# EAGLE design main-uass (EAGLE 9.6.2)
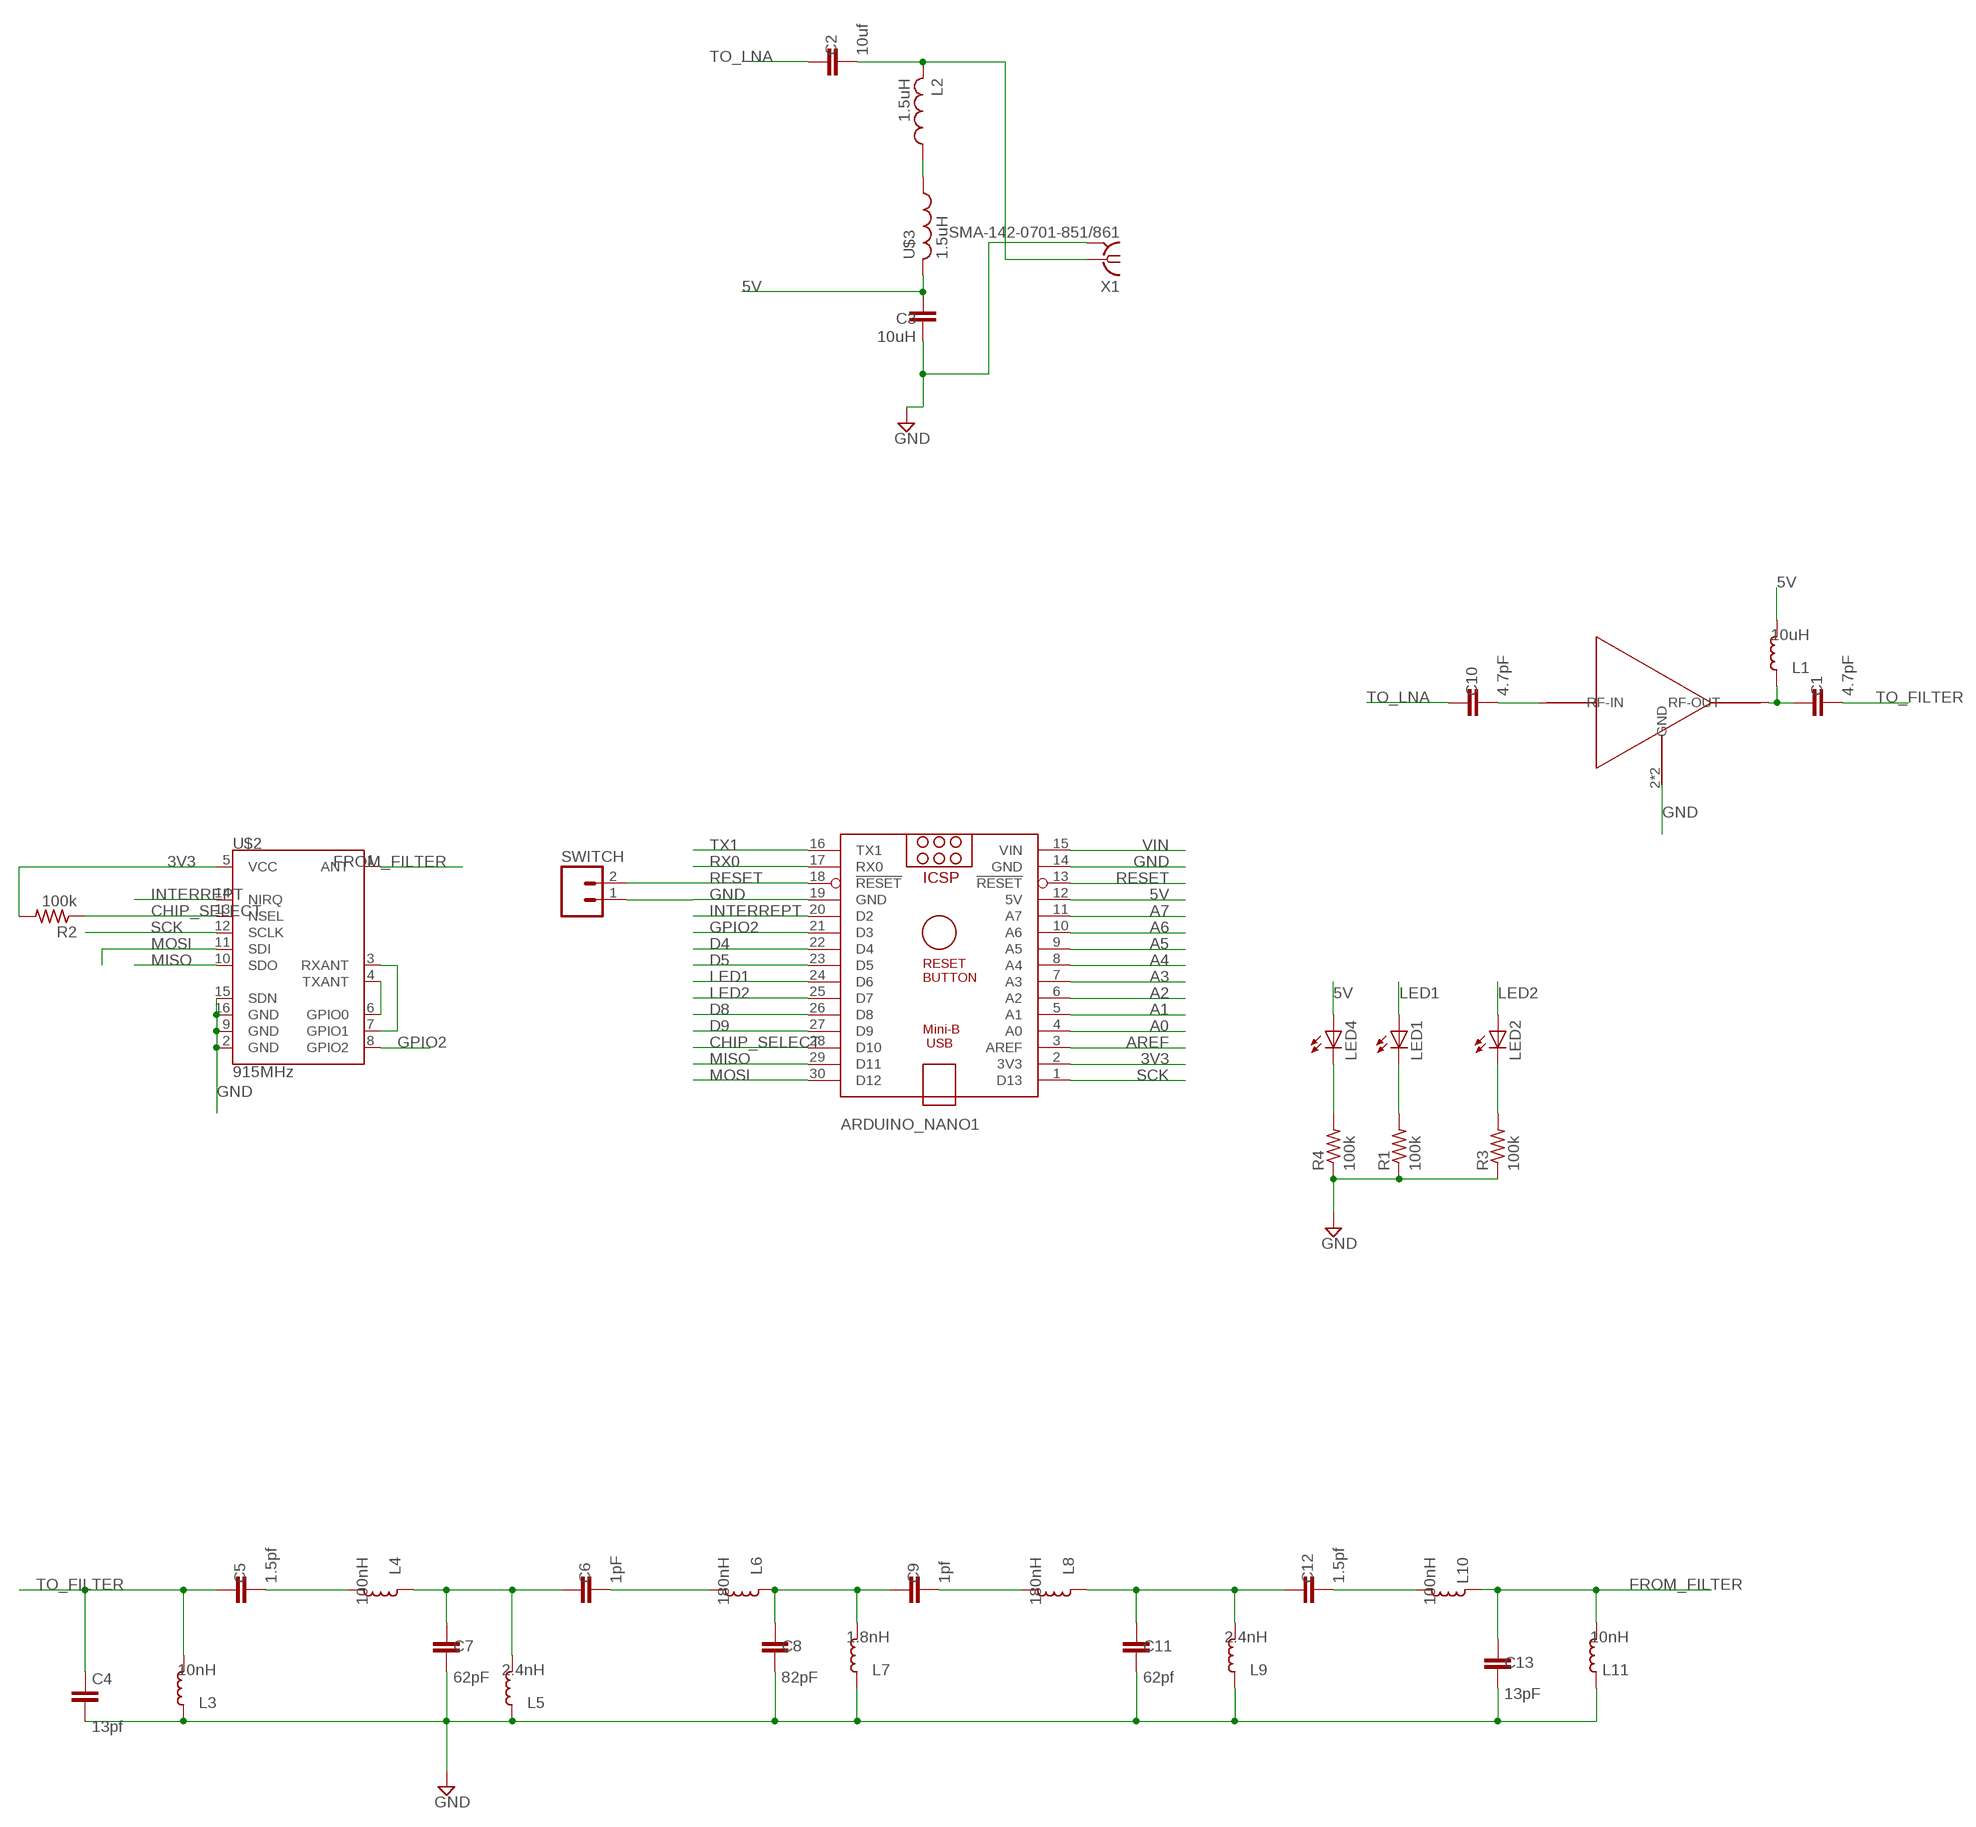
[diagram p0: schematic, sheet 1]

## Parts
ARDUINO_NANO1  ARDUINO_NANO  [ARDUINO_NANO]
C1  4.7pF  10UF-0603-6.3V-20%  [0603]
C2  10uf  10UF-0603-6.3V-20%  [0603]
C3  10uH  10UF-0603-6.3V-20%  [0603]
C4  13pf  10UF-0603-6.3V-20%  [0603]
C5  1.5pf  10UF-0603-6.3V-20%  [0603]
C6  1pF  10UF-0603-6.3V-20%  [0603]
C7  62pF  10UF-0603-6.3V-20%  [0603]
C8  82pF  10UF-0603-6.3V-20%  [0603]
C9  1pf  10UF-0603-6.3V-20%  [0603]
C10  4.7pF  10UF-0603-6.3V-20%  [0603]
C11  62pf  10UF-0603-6.3V-20%  [0603]
C12  1.5pf  10UF-0603-6.3V-20%  [0603]
C13  13pF  10UF-0603-6.3V-20%  [0603]
L1  10uH  L_0603  [L0603]
L2  1.5uH  L504  [C0504]
L3  10nH  L_0603  [L0603]
L4  100nH  L_0603  [L0603]
L5  2.4nH  L_0603  [L0603]
L6  180nH  L_0603  [L0603]
L7  1.8nH  L_0603  [L0603]
L8  180nH  L_0603  [L0603]
L9  2.4nH  L_0603  [L0603]
L10  100nH  L_0603  [L0603]
L11  10nH  L_0603  [L0603]
LED1  LED5MM  [LED5MM]
LED2  LED5MM  [LED5MM]
LED4  LED5MM  [LED5MM]
R1  100k  R-US_R0603  [R0603]
R2  100k  R-US_R0603  [R0603]
R3  100k  R-US_R0603  [R0603]
R4  100k  R-US_R0603  [R0603]
SWITCH  M02  [02P]
U$1  PSA4-5043+  [PSA4-5043+]
U$2  915MHz  RFM22915MHZ  [RFM22-XXX-S2]
U$3  1.5uH  L504  [C0504]
X1  SMA-142-0701-851/861  [J502-ND-142-0701-851/861]

## Nets
3V3: ARDUINO_NANO1.2(3V3) R2.2 U$2.5(VCC)
5V: ARDUINO_NANO1.12(5V) C3.2 L1.1 LED4.A U$3.2
A0: ARDUINO_NANO1.4(A0)
A1: ARDUINO_NANO1.5(A1)
A2: ARDUINO_NANO1.6(A2)
A3: ARDUINO_NANO1.7(A3)
A4: ARDUINO_NANO1.8(A4)
A5: ARDUINO_NANO1.9(A5)
A6: ARDUINO_NANO1.10(A6)
A7: ARDUINO_NANO1.11(A7)
AREF: ARDUINO_NANO1.3(AREF)
CHIP_SELECT: ARDUINO_NANO1.28(D10) R2.1 U$2.13(NSEL)
D4: ARDUINO_NANO1.22(D4)
D5: ARDUINO_NANO1.23(D5)
D8: ARDUINO_NANO1.26(D8)
D9: ARDUINO_NANO1.27(D9)
FROM_FILTER: C13.1 L10.2 L11.1 U$2.1(ANT)
GND: ARDUINO_NANO1.14(GND) ARDUINO_NANO1.19(GND) C3.1 C4.2 C7.2 C8.2 C11.2 C13.2 L3.2 L5.2 L7.2 L9.2 L11.2 R1.1 R3.1 R4.1 SWITCH.1 U$1.2(GND) U$1.4(GND) U$2.2(GND) U$2.9(GND) U$2.15(SDN) U$2.16(GND) X1.G@1 X1.G@2 X1.G@3 X1.G@4
GPIO2: ARDUINO_NANO1.21(D3) U$2.8(GPIO2)
INTERREPT: ARDUINO_NANO1.20(D2) U$2.14(NIRQ)
LED1: ARDUINO_NANO1.24(D6) LED1.A
LED2: ARDUINO_NANO1.25(D7) LED2.A
MISO: ARDUINO_NANO1.29(D11) U$2.10(SDO)
MOSI: ARDUINO_NANO1.30(D12) U$2.11(SDI)
N$1: U$2.4(TXANT) U$2.6(GPIO0)
N$2: U$2.3(RXANT) U$2.7(GPIO1)
N$3: L2.1 U$3.1
N$4: C5.2 L4.1
N$5: C6.1 C7.1 L4.2 L5.1
N$6: C6.2 L6.1
N$7: C8.1 C9.1 L6.2 L7.1
N$8: C9.2 L8.1
N$9: C11.1 C12.1 L8.2 L9.1
N$10: C12.2 L10.1
N$11: LED2.K(C) R3.2
N$30: LED4.K(C) R4.2
N$31: LED1.K(C) R1.2
N$33: C10.2 U$1.3(RF-IN)
N$34: C1.1 L1.2 U$1.1(RF-OUT)
N$46: C2.2 L2.2 X1.1
RESET: ARDUINO_NANO1.13(!RESET) ARDUINO_NANO1.18(!RESET) SWITCH.2
RX0: ARDUINO_NANO1.17(RX0)
SCK: ARDUINO_NANO1.1(D13) U$2.12(SCLK)
TO_FILTER: C1.2 C4.1 C5.1 L3.1
TO_LNA: C2.1 C10.1
TX1: ARDUINO_NANO1.16(TX1)
VIN: ARDUINO_NANO1.15(VIN)

## Library data of the parts
ARDUINO_NANO1 = ArduinoNanoV30:ARDUINO_NANO: Arduino Nano V3.0 Overview: The Arduino Nano is a small, complete, and breadboard-friendly board based on the ATmega328 (Arduino Nano 3.x) or ATmega168 (Arduino Nano 2.x). It has more or less the same functionality of the Arduino Duemilanove, but in a different package. It lacks only a DC power jack, and works with a Mini-B USB cable instead of a standard one. The Nano was designed and is being produced by Gravitech. Specifications: Microcontroller Atmel ATmega168 or ATmega328 Operating Voltage (logic level) 5 V Input Voltage (recommended) 7-12 V Input Voltage (limits) 6-20 V Digital I/O Pins 14 (of which 6 provide PWM output) Analog Input Pins 8 DC Current per I/O Pin 40 mA Flash Memory 16 KB (ATmega168) or 32 KB (ATmega328) of which 2 KB used by bootloader SRAM 1 KB (ATmega168) or 2 KB (ATmega328) EEPROM 512 bytes (ATmega168) or 1 KB (ATmega328) Clock Speed 16 MHz Dimensions 0.73" x 1.70" Length 45 mm Width 18 mm Weigth 5 g Power: The Arduino Nano can be powered via the Mini-B USB connection, 6-20V unregulated external power supply (pin 30), or 5V regulated external power supply (pin 27). The power source is automatically selected to the highest voltage source. Memory: The ATmega168 has 16 KB of flash memory for storing code (of which 2 KB is used for the bootloader); the ATmega328 has 32 KB, (also with 2 KB used for the bootloader). The ATmega168 has 1 KB of SRAM and 512 bytes of EEPROM (which can be read and written with the EEPROM library); the ATmega328 has 2 KB of SRAM and 1 KB of EEPROM. Input and Output: Each of the 14 digital pins on the Nano can be used as an input or output, using pinMode(), digitalWrite(), and digitalRead() functions. They operate at 5 volts. Each pin can provide or receive a maximum of 40 mA and has an internal pull-up resistor (disconnected by default) of 20-50 kOhms. In addition, some pins have specialized functions. Visit Arduino - ArduinoBoardNano <https://www.arduino.cc/en/Main/ArduinoBoardNano>
C1-C13 = SparkFun-Capacitors:10UF: 10.0µF ceramic capacitors A capacitor is a passive two-terminal electrical component used to store electrical energy temporarily in an electric field.; PROD_ID: CAP-11015; VALUE: 10uF
L1 L3-L11 = rc-master-smd:L_: INDUCTOR
L2 U$3 = rcl-2:L504
LED1 LED2 LED4 = adafruit:LED: LED OSRAM: - CHIPLED LG R971, LG N971, LY N971, LG Q971, LY Q971, LO R971, LY R971 LH N974, LH R974 LS Q976, LO Q976, LY Q976 LO Q996 - Hyper CHIPLED LW Q18S LB Q993, LB Q99A, LB R99A - SideLED LS A670, LO A670, LY A670, LG A670, LP A670 LB A673, LV A673, LT A673, LW A673 LH A674 LY A675 LS A676, LA A676, LO A676, LY A676, LW A676 LS A679, LY A679, LG A679 - Hyper Micro SIDELED® LS Y876, LA Y876, LO Y876, LY Y876 LT Y87S - SmartLED LW L88C, LW L88S LB L89C, LB L89S, LG L890 LS L89K, LO L89K, LY L89K LS L896, LA L896, LO L896, LY L896 - TOPLED LS T670, LO T670, LY T670, LG T670, LP T670 LSG T670, LSP T670, LSY T670, LOP T670, LYG T670 LG T671, LOG T671, LSG T671 LB T673, LV T673, LT T673, LW T673 LH T674 LS T676, LA T676, LO T676, LY T676, LB T676, LH T676, LSB T676, LW T676 LB T67C, LV T67C, LT T67C, LS T67K, LO T67K, LY T67K, LW E67C LS E67B, LA E67B, LO E67B, LY E67B, LB E67C, LV E67C, LT E67C LW T67C LS T679, LY T679, LG T679 LS T770, LO T770, LY T770, LG T770, LP T770 LB T773, LV T773, LT T773, LW T773 LH T774 LS E675, LA E675, LY E675, LS T675 LS T776, LA T776, LO T776, LY T776, LB T776 LHGB T686 LT T68C, LB T68C - Hyper Mini TOPLED® LB M676 - Mini TOPLED Santana® LG M470 LS M47K, LO M47K, LY M47K Source: http://www.osram.convergy.de/
R1-R4 = adafruit:R-US_: RESISTOR, American symbol
SWITCH = con-amp-quick:M02: AMP QUICK CONNECTOR; OC_FARNELL: unknown; OC_NEWARK: unknown
U$1 = PSA4-5043_:PSA4-5043+; AVAILABILITY: Unavailable; DESCRIPTION: Ultra Low Noise MMIC Amplifier, 50ohm, 0.05 to 4 GHz; MF: Mini-Circuits; MP: PSA4-5043+; PACKAGE: None; PRICE: None
U$2 = SparkFun-RF:RFM22: Hope RF RFM22 ISM Transciever Module The RFM22 is a low-power, low cost radio that is capable of operating in the 434MHz and 900MHz open bands. It's frequency is software defined and there are some very good libraries written for it. SparkFun Products SparkFun RFM22 Shield - 434MHz <https://www.sparkfun.com/products/11018> (DEV-11018); PROD_ID: IC-11750; SF_ID: WRL-12030
X1 = con-coax:SMA-: SMA 50 Ohm End Launch Jack Receptacle - Round Contact Johnson Components Source: www.johnsoncomponents.com .. J502-ND.pdf; MF: JOHNSON COMPONENTS; MPN: 142-0701-851; OC_FARNELL: 1019325; OC_NEWARK: 99F6798

## Net classes
0 default: width 0.305 mm, clearance 0.051 mm

## Board
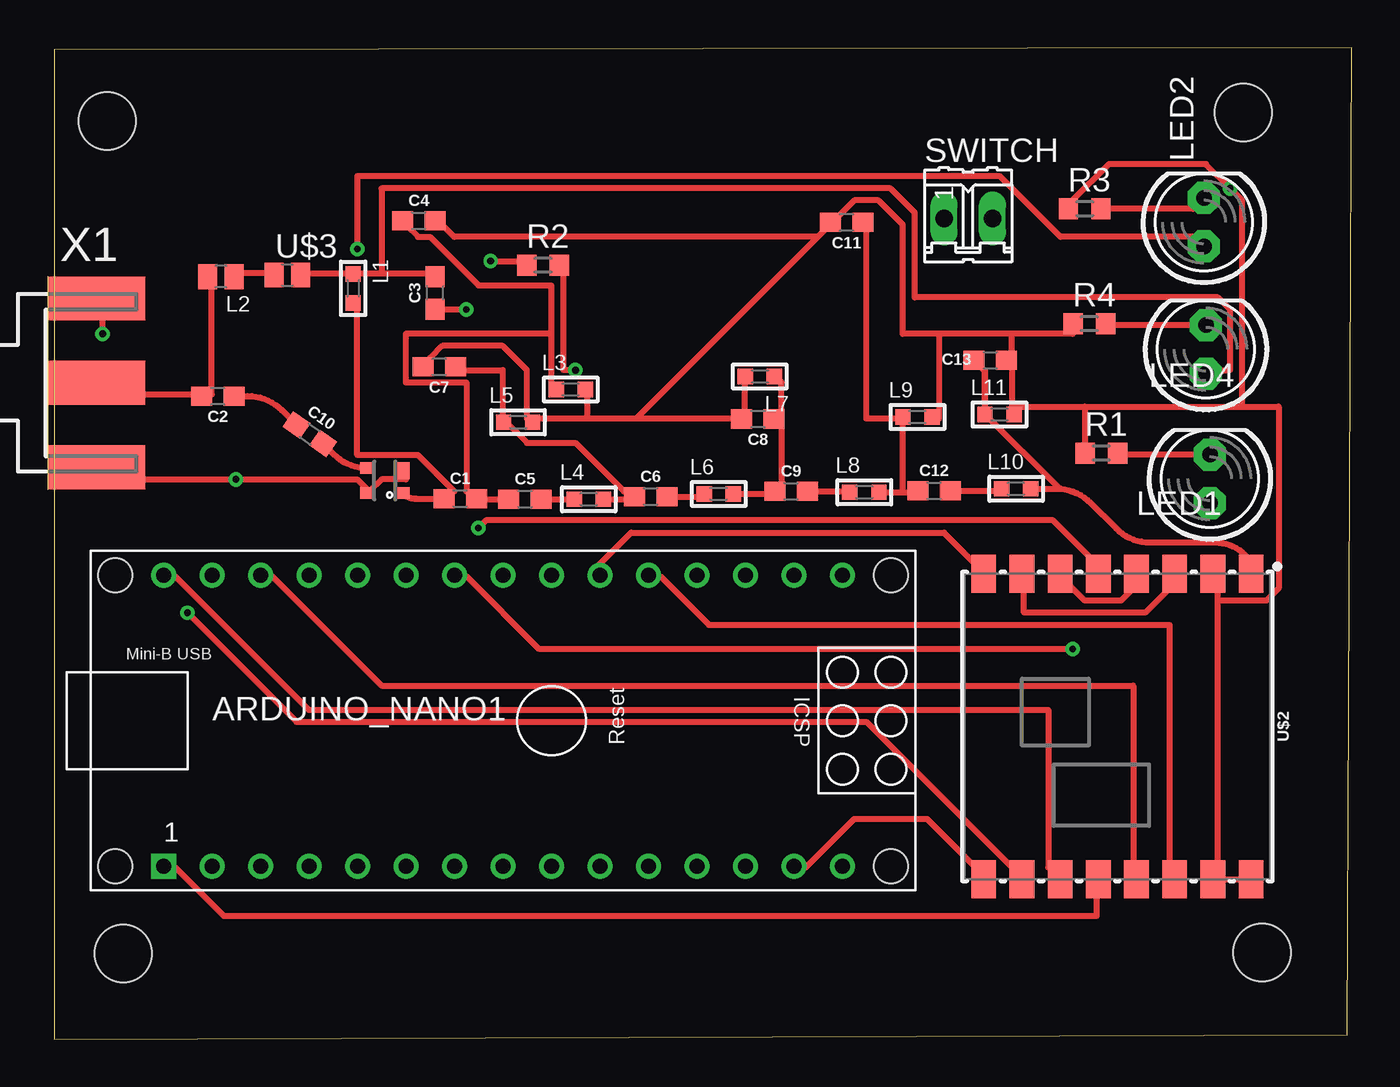
[diagram p1: board, top side]
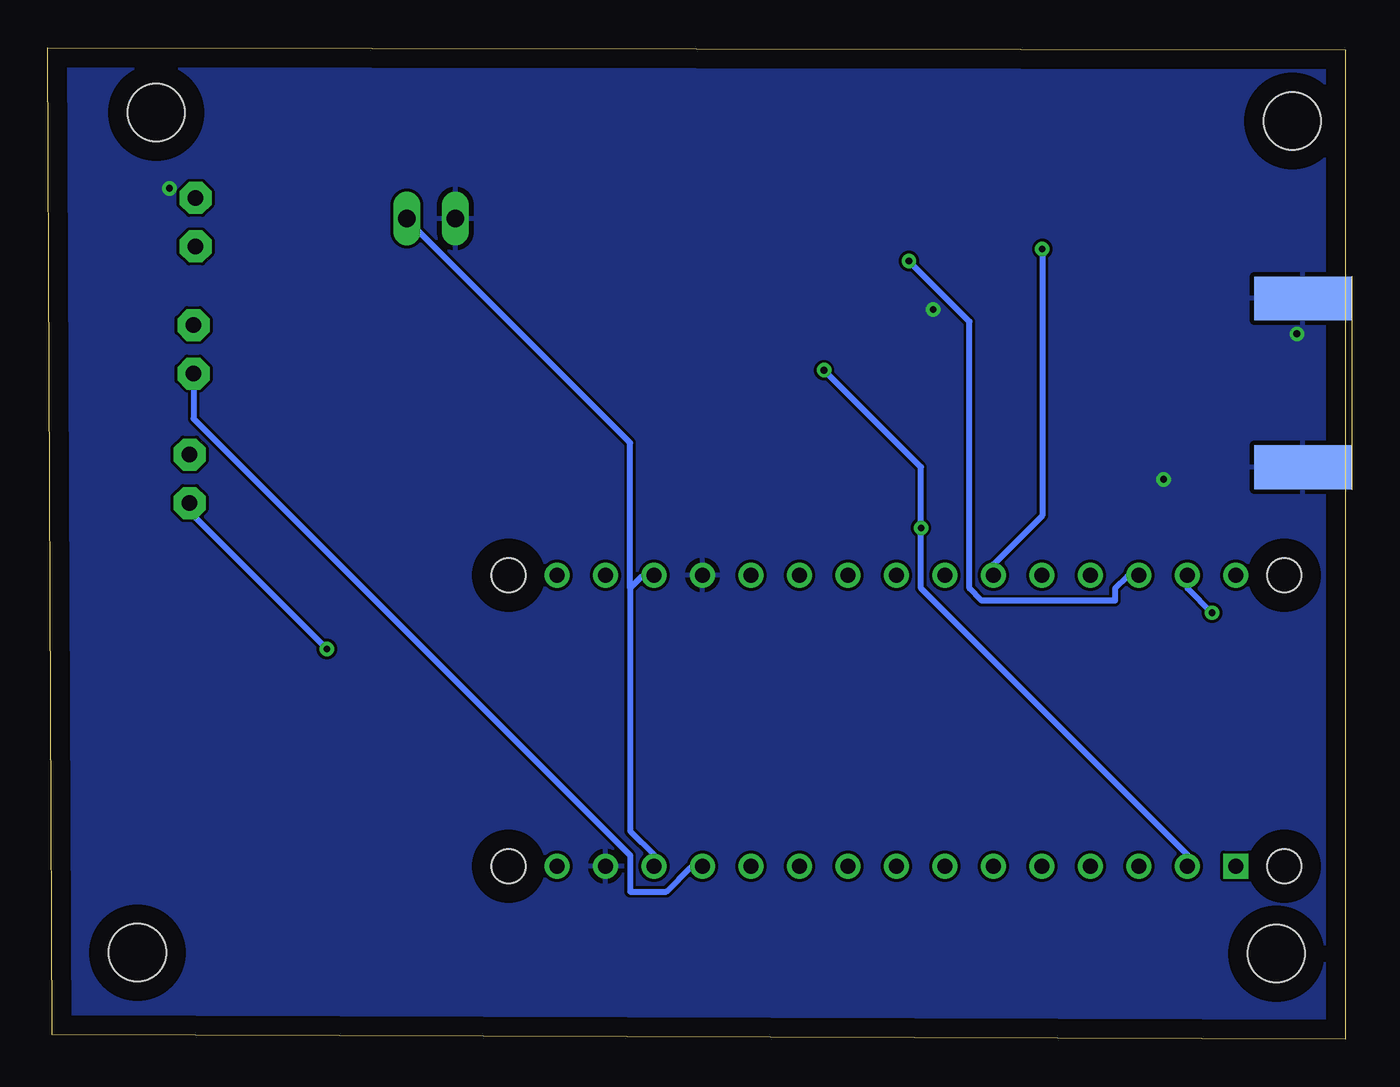
[diagram p2: board, bottom side, seen from below]

Size 67.97 x 51.91 mm. Coordinates in mm from the lower left corner, seen from the top.
Outline: 0,0 67.74,0.23 67.97,51.91 0,51.82 0,0
Copper layers (1*16): Top 0.035mm / dielectric 1.5mm / Bottom 0.035mm
Design rules "default": minimum track width 6mil, minimum drill 0.35mm, track to track 6mil, track to pad 6mil, pad to pad 6mil, via to via 6mil, smd to smd 6mil, copper to edge 40mil, drill to drill 6mil, minimum pad ring 10mil, minimum via ring 8mil, stop-mask expansion 4mil, vias tented up to drill 0mil, thermal gap 10mil
Holes 3 mm at 3.62,4.48 63.27,4.53 62.29,48.52 2.79,48.07

### Footprints (pad centres in the part's own frame; a part is rotated, then mirrored left to right if it is on the bottom)
ARDUINO_NANO = drill 0.8 square: 1 -20.32,-7.62 | drill 0.8: 2 -17.78,-7.62; 3 -15.24,-7.62; 4 -12.7,-7.62; 5 -10.16,-7.62; 6 -7.62,-7.62; 7 -5.08,-7.62; 8 -2.54,-7.62; 9 0,-7.62; 10 2.54,-7.62; 11 5.08,-7.62; 12 7.62,-7.62; 13 10.16,-7.62; 14 12.7,-7.62; 15 15.24,-7.62; 16 15.24,7.62; 17 12.7,7.62; 18 10.16,7.62; 19 7.62,7.62; 20 5.08,7.62; 21 2.54,7.62; 22 0,7.62; 23 -2.54,7.62; 24 -5.08,7.62; 25 -7.62,7.62; 26 -10.16,7.62; 27 -12.7,7.62; 28 -15.24,7.62; 29 -17.78,7.62; 30 -20.32,7.62 | hole 1.778: -22.86,-7.62; -22.86,7.62; 17.78,7.62; 17.78,-7.62
0603 = smd 1.1 x 1: 1 -0.85,0; 2 0.85,0
L0603 = smd 0.8 x 0.8: 1 -0.762,0; 2 0.762,0
C0504 = smd 1 x 1.3: 1 -0.7,0; 2 0.7,0
LED5MM = drill 0.813 pad 1.676 octagon: A -1.27,0; K 1.27,0
R0603 = smd 1 x 1.1: 1 -0.85,0; 2 0.85,0
02P = drill 0.914 long: 1 -1.27,0; 2 1.27,0
PSA4-5043+ = smd 0.6 x 0.8: 1 -0.65,-0.9; 3 0.65,0.9; 4 -0.65,0.9 | smd 0.9 x 0.8: 2 0.5,-0.9
RFM22-XXX-S2 = smd 2 x 1.3: 1 -8,7; 2 -8,5; 3 -8,3; 4 -8,1; 5 -8,-1; 6 -8,-3; 7 -8,-5; 8 -8,-7; 9 8,-7; 10 8,-5; 11 8,-3; 12 8,-1; 13 8,1; 14 8,3; 15 8,5; 16 8,7
J502-ND-142-0701-851/861 = smd 5.08 x 2.286: 1 2.565,0; G@1 2.565,4.42; G@2 2.565,-4.42 | smd 5.08 x 2.286 bottom: G@3 2.565,4.42; G@4 2.565,-4.42

### Placement (x,y rotation side)
ARDUINO_NANO1  26.06,16.68 0 top
C1  21.27,28.3 0 top
C2  8.57,33.67 180 top
C3  19.96,39.07 90 top
C4  19.1,42.85 0 top
C5  24.66,28.27 0 top
C6  31.25,28.4 0 top
C7  20.18,35.2 180 top
C8  36.87,32.47 180 top
C9  38.6,28.68 0 top
C10  13.39,31.68 324.9 top
C11  41.51,42.77 180 top
C12  46.09,28.71 0 top
C13  49.04,35.55 0 top
L1  15.67,39.31 270 top
L2  8.74,39.93 180 top
L3  27.06,34.01 0 top
L4  28,28.27 0 top
L5  24.3,32.3 0 top
L6  34.81,28.55 0 top
L7  36.96,34.7 180 top
L8  42.44,28.64 0 top
L9  45.23,32.58 0 top
L10  50.39,28.82 0 top
L11  49.52,32.71 0 top
LED1  60.54,29.34 90 top
LED2  60.23,42.78 90 top
LED4  60.33,36.12 90 top
R1  54.86,30.69 0 top
R2  25.61,40.53 0 top
R3  53.98,43.48 0 top
R4  54.23,37.46 0 top
SWITCH  47.88,42.97 0 top
U$1  17.32,29.26 90 top
U$2  55.69,16.37 270 top
U$3  12.22,40.01 0 top
X1  -0.33,34.37 0 top

### Tracks (layer width: path | path; a pad name or v marks a point on that pad's centre or on a via)
3V3  (via drill 0.35)
  Top 0.305: v27.31,35.03 26.67,35.03 26.67,40.11 R2.2 | v22.23,26.77 22.62,27.16 52.32,27.16 54.61,24.87 U$2.5
  Bottom 0.305: v27.31,35.03 22.23,29.95 v22.23,26.77 22.23,23.6 8.26,9.63 ARDUINO_NANO1.2
5V
  Top 0.305: 15.88,40.11 13.34,40.11 U$3.2 | 15.88,40.11 17.15,40.11 | 17.15,40.11 19.69,40.11 C3.2 | 15.88,40.11 L1.1 | 17.15,40.11 17.15,44.55 43.82,44.55 45.09,43.28 45.09,38.84 60.96,38.84 61.6,38.2 61.6,35.03 60.96,35.03 LED4.A
  Bottom 0.305: ARDUINO_NANO1.12 34.29,8.99 35.56,7.72 37.47,7.72 37.47,9.63 60.33,32.49 60.33,34.39 LED4.A
CHIP_SELECT  (via drill 0.35)
  Top 0.305: v22.86,40.74 24.77,40.74 R2.1 | U$2.13 56.52,8.99 56.52,18.52 17.15,18.52 11.43,24.23 ARDUINO_NANO1.28
  Bottom 0.305: v22.86,40.74 19.69,37.57 19.69,23.6 19.05,22.96 12.07,22.96 12.07,23.6 11.43,24.23 ARDUINO_NANO1.28
FROM_FILTER
  Top 0.305: U$2.1 arc45 62.75,24.52 62.75,24.98 62.36,25.37 arc45 60.82,26.01 57.4,26.01 arc-45 55.63,26.74 54.29,28.08 arc40 52.72,28.81 52.71,28.82 L10.2 52.49,28.82 arc-5 52.67,28.82 48.76,32.73 48.76,34.97 C13.1 48.76,34.98 L11.1 48.9,32.49
GND  (via drill 0.35)
  Top 0.305: 30.48,32.49 35.56,32.49 C8.2 36.2,32.49 36.2,34.39 L7.2 | 30.48,32.49 27.94,32.49 | 27.94,32.49 25.4,32.49 L5.2 24.77,32.49 24.77,35.03 23.5,36.3 20.32,36.3 19.69,35.66 C7.2 | 27.94,32.49 27.94,33.76 L3.2 | 30.48,32.49 40.01,42.01 | 40.01,42.01 40.64,42.65 | 40.01,42.01 20.96,42.01 20.32,42.65 C4.2 | 16.51,28.68 17.15,29.31 18.42,29.31 U$1.2 | 16.51,28.68 15.88,29.31 v9.53,29.31 3.18,29.31 2.54,29.95 X1.G@2 | 16.51,28.68 U$1.4 | U$2.16 62.23,8.36 60.96,8.36 U$2.15 60.96,8.99 60.96,22.96 | 60.96,22.96 60.96,24.23 U$2.2 | 46.36,36.93 46.36,32.49 L9.2 | 50.17,36.93 53.34,36.93 R4.1 | 50.17,36.93 46.36,36.93 | v21.59,38.2 20.32,38.2 C3.1 | 50.17,35.66 50.17,33.12 | 50.17,33.12 50.17,32.49 L11.2 | 62.23,33.12 62.23,43.92 v61.6,44.55 60.33,45.82 55.25,45.82 53.34,43.92 R3.1 | 50.17,33.12 53.98,33.12 | 53.98,33.12 62.23,33.12 | 53.98,33.12 53.98,31.22 R1.1 | U$2.9 48.26,8.99 45.72,11.53 41.91,11.53 39.37,8.99 ARDUINO_NANO1.14 | 50.17,35.66 50.17,36.93 | 50.17,35.66 C13.2 | v2.54,36.93 2.54,38.2 X1.G@3 | 60.96,22.96 63.5,22.96 64.14,23.6 64.14,33.12 62.23,33.12 | 40.64,42.65 41.91,43.92 43.18,43.92 44.45,42.65 44.45,36.93 46.36,36.93 | 40.64,42.65 C11.2
  pour Bottom: -3,55.1 71,55.1 71,-2.9 -3,-2.9
GPIO2
  Top 0.305: U$2.8 48.26,24.87 46.61,26.52 30.23,26.52 28.58,24.87 ARDUINO_NANO1.21
INTERREPT
  Top 0.305: U$2.14 58.42,8.99 58.42,21.69 34.29,21.69 31.75,24.23 ARDUINO_NANO1.20
LED1  (via drill 0.35)
  Top 0.305: v53.34,20.42 25.4,20.42 21.59,24.23 ARDUINO_NANO1.24
  Bottom 0.305: v53.34,20.42 60.33,27.41 60.33,28.04 LED1.A
LED2  (via drill 0.35)
  Top 0.305: v15.88,41.38 15.88,45.19 49.53,45.19 52.71,42.01 59.69,42.01 LED2.A
  Bottom 0.305: v15.88,41.38 15.88,27.41 18.42,24.87 ARDUINO_NANO1.25
MISO  (via drill 0.35)
  Top 0.305: v6.99,22.33 12.7,16.61 42.55,16.61 50.17,8.99 U$2.10
  Bottom 0.305: v6.99,22.33 8.26,23.6 8.26,24.23 ARDUINO_NANO1.29
MOSI
  Top 0.305: U$2.11 52.07,8.99 52.07,17.25 13.34,17.25 6.35,24.23 ARDUINO_NANO1.30
N$1
  Top 0.305: U$2.6 52.71,24.23 53.98,22.96 55.88,22.96 57.15,24.23 U$2.4
N$2
  Top 0.305: U$2.7 50.8,24.23 50.8,22.33 57.15,22.33 59.06,24.23 U$2.3
N$3
  Top 0.305: L2.1 9.53,40.11 11.43,40.11 U$3.1
N$4
  Top 0.305: C5.2 L4.1
N$5
  Top 0.305: L4.2 30.27,28.27 C6.1 29.85,28.68 27.31,31.22 24.77,31.22 23.5,32.49 | 23.5,32.49 23.5,35.03 20.96,35.03 C7.1 | 23.5,32.49 L5.1
N$6
  Top 0.305: C6.2 33.9,28.4 L6.1
N$7
  Top 0.305: L6.2 37.62,28.55 C9.1 38.1,28.68 38.1,32.49 | 38.1,32.49 38.1,34.39 L7.1 | 38.1,32.49 C8.1
N$8
  Top 0.305: C9.2 41.63,28.68 L8.1
N$9
  Top 0.305: L8.2 44.45,28.64 | 44.45,28.64 45.17,28.64 C12.1 | 44.45,28.64 44.45,32.49 | 44.45,32.49 42.55,32.49 42.55,42.65 C11.1 | 44.45,32.49 L9.1
N$10
  Top 0.305: C12.2 49.52,28.71 L10.1
N$11
  Top 0.305: LED2.K 59.66,43.48 R3.2
N$30
  Top 0.305: LED4.K 55.15,37.38 R4.2
N$31
  Top 0.305: LED1.K 55.78,30.61 R1.2
N$33
  Top 0.305: C10.2 14.62,30.65 arc45 U$1.3
N$34
  Top 0.305: U$1.1 arc45 18.97,28.3 C1.1 20.96,28.68 19.05,30.58 15.88,30.58 15.88,38.2 L1.2
N$46
  Top 0.305: X1.1 2.87,33.73 7.67,33.73 C2.2 8.26,33.76 8.26,39.47 L2.2
RESET
  Bottom 0.305: 37.47,23.6 37.47,10.9 36.2,9.63 ARDUINO_NANO1.13 | 37.47,23.6 36.83,24.23 ARDUINO_NANO1.18 | 37.47,23.6 37.47,31.22 48.9,42.65 SWITCH.2
SCK
  Top 0.305: U$2.12 54.61,8.36 54.61,6.45 8.89,6.45 6.35,8.99 ARDUINO_NANO1.1
TO_FILTER
  Top 0.305: C5.1 22.15,28.27 C1.2 21.59,28.68 21.59,34.39 18.42,34.39 18.42,36.93 26.04,36.93 | 26.04,36.93 26.04,39.47 22.23,39.47 19.69,42.01 19.05,42.01 18.42,42.65 C4.1 | 26.04,36.93 26.04,34.39 L3.1
TO_LNA
  Top 0.305: C2.1 10.14,33.67 arc-45 11.93,32.93 C10.1